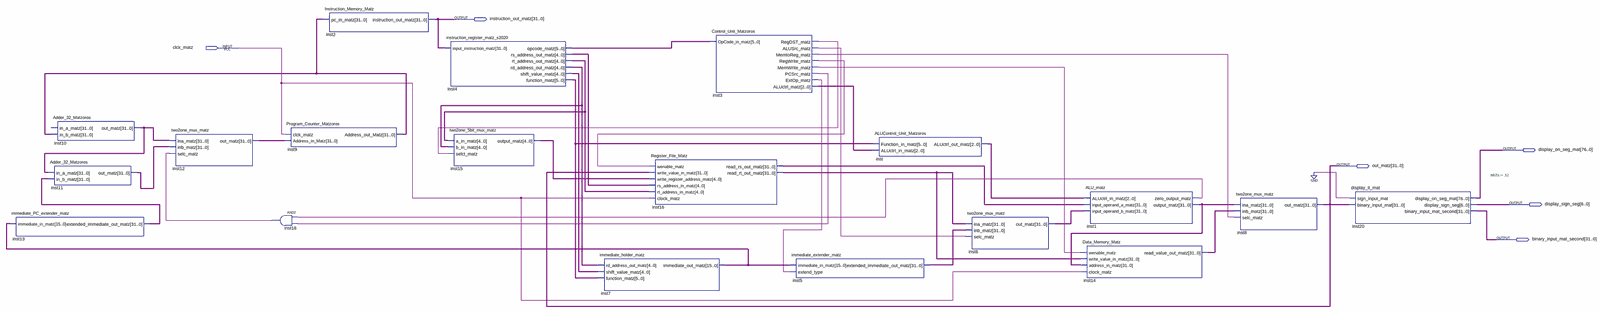
[diagram p0: schematic sheet, whole]
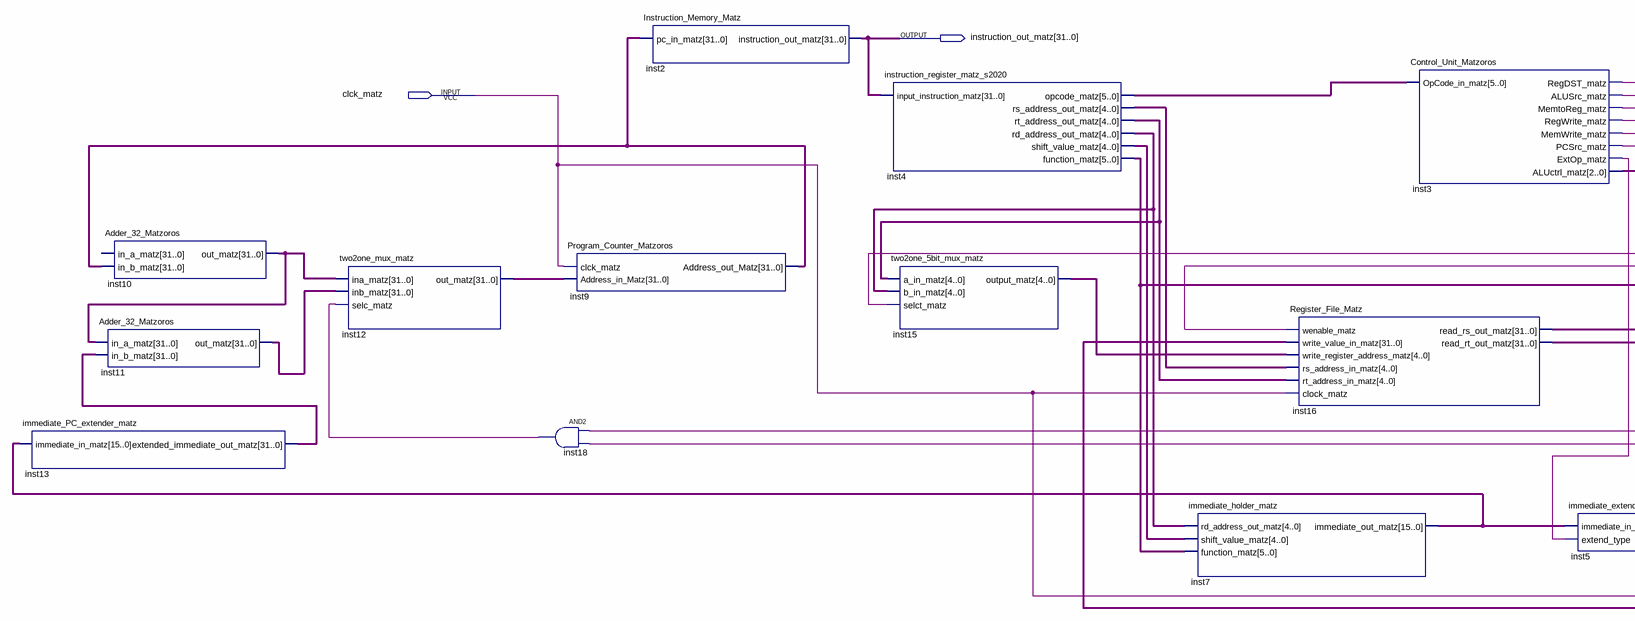
[diagram p1: schematic sheet, left part]
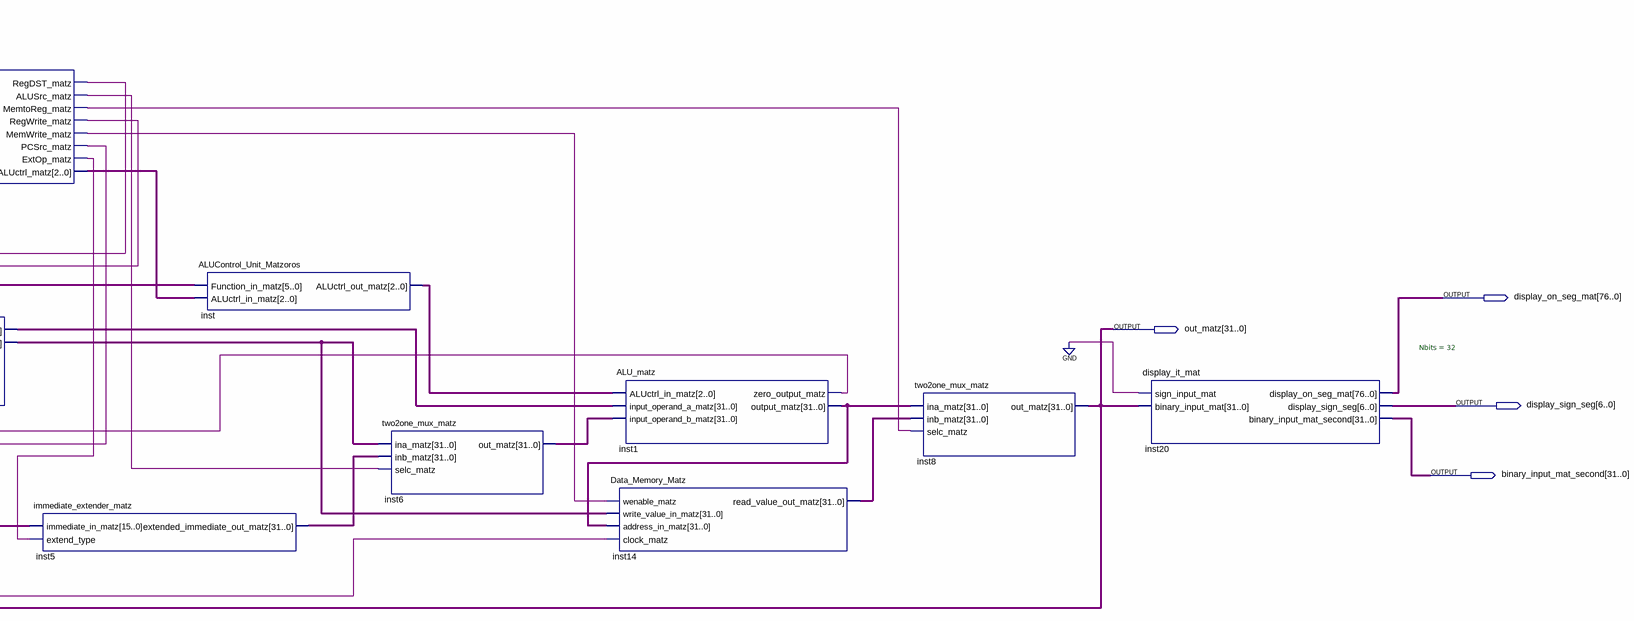
[diagram p2: schematic sheet, right part]
// Quartus schematic SingleCycleCPU_Matzoros.bdf as structural Verilog: 19 symbols, 6 pins
module SingleCycleCPU_Matzoros (
  input  clck_matz,
  output [31:0] instruction_out_matz,
  output [76:0] display_on_seg_mat,
  output [31:0] out_matz,
  output [6:0] display_sign_seg,
  output [31:0] binary_input_mat_second
);

  wire inst1_zero_output_matz, inst3_alusrc_matz, inst3_extop_matz, inst3_memtoreg_matz, inst3_memwrite_matz,
       inst3_pcsrc_matz, inst3_regdst_matz, inst3_regwrite_matz, inst18_out;
  wire [2:0] inst3_aluctrl_matz, inst_aluctrl_out_matz;
  wire [4:0] inst4_rd_address_out_matz, inst4_rs_address_out_matz, inst4_rt_address_out_matz,
       inst4_shift_value_matz, inst15_output_matz;
  wire [5:0] inst4_function_matz, inst4_opcode_matz;
  wire [15:0] inst7_immediate_out_matz;
  wire [31:0] inst1_output_matz, inst5_extended_immediate_out_matz, inst6_out_matz, inst9_address_out_matz,
       inst10_out_matz, inst11_out_matz, inst12_out_matz, inst13_extended_immediate_out_matz,
       inst14_read_value_out_matz, inst16_read_rs_out_matz, inst16_read_rt_out_matz;

  immediate_PC_extender_matz inst13 (
    .immediate_in_matz(inst7_immediate_out_matz),
    .extended_immediate_out_matz(inst13_extended_immediate_out_matz));
  Adder_32_Matzoros inst10 (.in_b_matz(inst9_address_out_matz), .out_matz(inst10_out_matz));  // open: in_a_matz
  Adder_32_Matzoros inst11 (
    .in_a_matz(inst10_out_matz), .in_b_matz(inst13_extended_immediate_out_matz), .out_matz(inst11_out_matz));
  two2one_mux_matz inst12 (
    .ina_matz(inst10_out_matz), .inb_matz(inst11_out_matz), .selc_matz(inst18_out), .out_matz(inst12_out_matz));
  and inst18 (inst18_out, inst1_zero_output_matz, inst3_pcsrc_matz);
  Program_Counter_Matzoros inst9 (
    .clck_matz(clck_matz), .Address_in_Matz(inst12_out_matz), .Address_out_Matz(inst9_address_out_matz));
  Instruction_Memory_Matz inst2 (.pc_in_matz(inst9_address_out_matz), .instruction_out_matz(instruction_out_matz));
  instruction_register_matz_s2020 inst4 (
    .input_instruction_matz(instruction_out_matz), .opcode_matz(inst4_opcode_matz),
    .rs_address_out_matz(inst4_rs_address_out_matz), .rt_address_out_matz(inst4_rt_address_out_matz),
    .rd_address_out_matz(inst4_rd_address_out_matz), .shift_value_matz(inst4_shift_value_matz),
    .function_matz(inst4_function_matz));
  two2one_5bit_mux_matz inst15 (
    .a_in_matz(inst4_rt_address_out_matz), .b_in_matz(inst4_rd_address_out_matz),
    .selct_matz(inst3_regdst_matz), .output_matz(inst15_output_matz));
  immediate_holder_matz inst7 (
    .rd_address_out_matz(inst4_rd_address_out_matz), .shift_value_matz(inst4_shift_value_matz),
    .function_matz(inst4_function_matz), .immediate_out_matz(inst7_immediate_out_matz));
  Register_File_Matz inst16 (
    .wenable_matz(inst3_regwrite_matz), .write_value_in_matz(out_matz),
    .write_register_address_matz(inst15_output_matz), .rs_address_in_matz(inst4_rs_address_out_matz),
    .rt_address_in_matz(inst4_rt_address_out_matz), .clock_matz(clck_matz),
    .read_rs_out_matz(inst16_read_rs_out_matz), .read_rt_out_matz(inst16_read_rt_out_matz));
  Control_Unit_Matzoros inst3 (
    .OpCode_in_matz(inst4_opcode_matz), .RegDST_matz(inst3_regdst_matz), .ALUSrc_matz(inst3_alusrc_matz),
    .MemtoReg_matz(inst3_memtoreg_matz), .RegWrite_matz(inst3_regwrite_matz),
    .MemWrite_matz(inst3_memwrite_matz), .PCSrc_matz(inst3_pcsrc_matz), .ExtOp_matz(inst3_extop_matz),
    .ALUctrl_matz(inst3_aluctrl_matz));
  immediate_extender_matz inst5 (
    .immediate_in_matz(inst7_immediate_out_matz), .extend_type(inst3_extop_matz),
    .extended_immediate_out_matz(inst5_extended_immediate_out_matz));
  ALUControl_Unit_Matzoros inst (
    .Function_in_matz(inst4_function_matz), .ALUctrl_in_matz(inst3_aluctrl_matz),
    .ALUctrl_out_matz(inst_aluctrl_out_matz));
  two2one_mux_matz inst6 (
    .ina_matz(inst16_read_rt_out_matz), .inb_matz(inst5_extended_immediate_out_matz),
    .selc_matz(inst3_alusrc_matz), .out_matz(inst6_out_matz));
  ALU_matz inst1 (
    .ALUctrl_in_matz(inst_aluctrl_out_matz), .input_operand_a_matz(inst16_read_rs_out_matz),
    .input_operand_b_matz(inst6_out_matz), .zero_output_matz(inst1_zero_output_matz),
    .output_matz(inst1_output_matz));
  Data_Memory_Matz inst14 (
    .wenable_matz(inst3_memwrite_matz), .write_value_in_matz(inst16_read_rt_out_matz),
    .address_in_matz(inst1_output_matz), .clock_matz(clck_matz),
    .read_value_out_matz(inst14_read_value_out_matz));
  two2one_mux_matz inst8 (
    .ina_matz(inst1_output_matz), .inb_matz(inst14_read_value_out_matz), .selc_matz(inst3_memtoreg_matz),
    .out_matz(out_matz));
  display_it_mat #(.Nbits(32)) inst20 (
    .sign_input_mat(1'b0), .binary_input_mat(out_matz), .display_on_seg_mat(display_on_seg_mat),
    .display_sign_seg(display_sign_seg), .binary_input_mat_second(binary_input_mat_second));
endmodule
